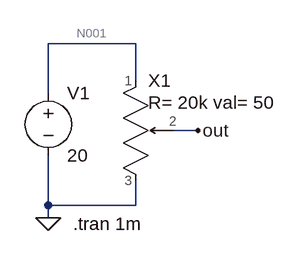
[diagram p0: schematic 01-Pot_genSymbol.asc]
01-Pot_genSymbol.asc, the LTspice schematic file:
Version 4
SHEET 1 880 680
WIRE 208 64 96 64
WIRE 208 112 208 64
WIRE 96 128 96 64
WIRE 288 176 256 176
WIRE 96 272 96 208
WIRE 208 272 208 240
WIRE 208 272 96 272
WIRE 96 288 96 272
FLAG 96 288 0
FLAG 288 176 out
SYMBOL voltage 96 112 R0
WINDOW 123 0 0 Left 0
WINDOW 39 0 0 Left 0
SYMATTR InstName V1
SYMATTR Value 20
SYMBOL pot 208 176 R0
WINDOW 39 16 -36 Left 2
SYMATTR InstName X1
SYMATTR SpiceLine R= 20k val= 50
TEXT 128 296 Left 2 !.tran 1m

The netlist it stands for:
* 01-Pot_genSymbol.asc
V1 N001 0 20
XX1 N001 out 0 pot R= 20k val= 50  ; pins 1 2 3
.tran 1m
.backanno
.end

* Results of the author's LTspice run, read from the files saved beside the schematic
* Operating Point, zero values left out:
*   V(n001) = 20 V
*   V(out) = 10 V
*   I(V1) = -1 mA
*   Ix(x1:1) = 1 mA
*   Ix(x1:3) = -1 mA
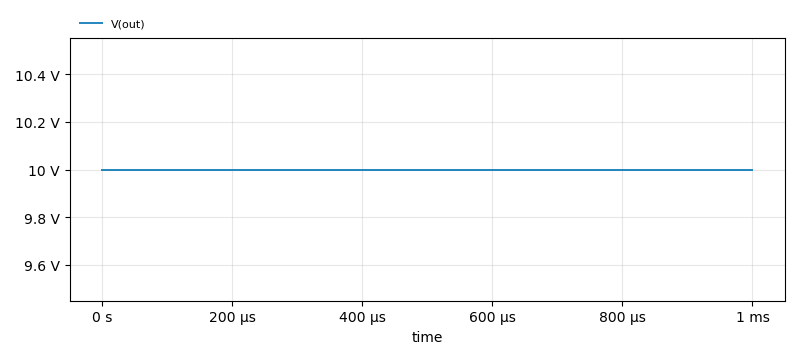
[diagram p1: Transient Analysis of 01-Pot_genSymbol.asc, plotted from the saved traces]
* Transient Analysis, 1 run:
*   V(out): min 10 V, max 10 V, average 10 V, rms 10 V, last 10 V